# EAGLE design MAIN_BOARD (EAGLE 9.6.1)

## Sheet 1 of 3
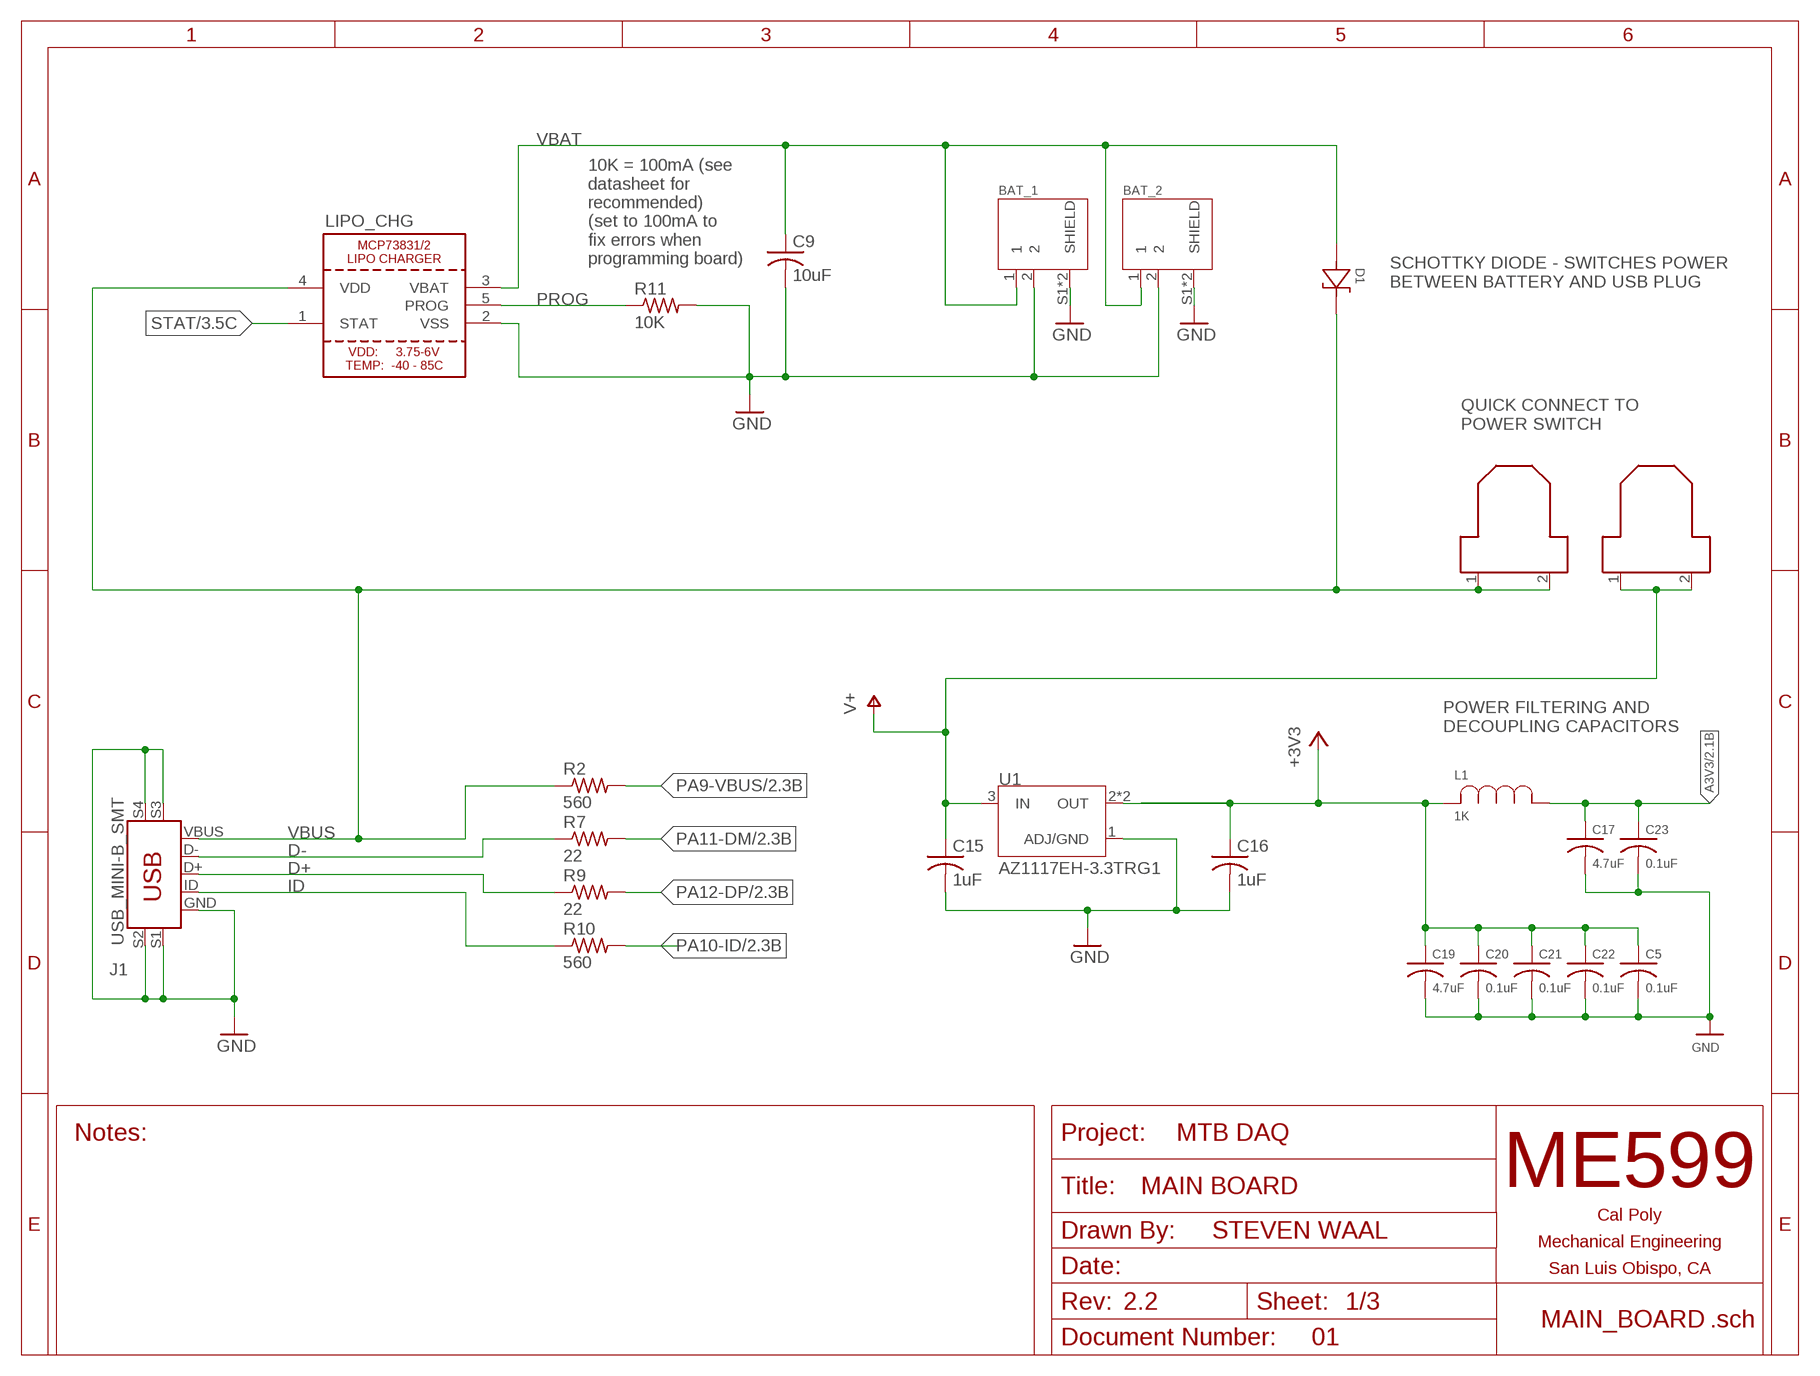
[diagram p0: schematic, sheet 1]
FRAME1 (TITLEBLOCK): AUTHOR: STEVEN WAAL; BOARD_NAME: MAIN BOARD; DOC_NUM: 01; PROJECT_NAME: MTB DAQ; REVISION: 2.2

### Parts
(+)  QUICK_CONNECT_0.187"  [QUICK_CONNECT_0.187"]
(-)  QUICK_CONNECT_0.187"  [QUICK_CONNECT_0.187"]
BAT_1  S2B-PH-SM4-TB(LF)(SN)  [JST_S2B-PH-SM4-TB(LF)(SN)]
BAT_2  S2B-PH-SM4-TB(LF)(SN)  [JST_S2B-PH-SM4-TB(LF)(SN)]
C5  0.1uF  C-USC0805  [C0805]
C9  10uF  C-USC0805  [C0805]
C15  1uF  C-USC0805  [C0805]
C16  1uF  C-USC0805  [C0805]
C17  4.7uF  C-USC0805  [C0805]
C19  4.7uF  C-USC0805  [C0805]
C20  0.1uF  C-USC0805  [C0805]
C21  0.1uF  C-USC0805  [C0805]
C22  0.1uF  C-USC0805  [C0805]
C23  0.1uF  C-USC0805  [C0805]
D1  DIODE_SCHOTTKY  [DIODE_SOD123W_1P9X2P8]
J1  USB_MINI-B_SMT  [USB-MINIB]
L1  1K  BEAD_120OHMS_100MHZ  [IND_VISHAY_ILHB0805]
LIPO_CHG  LIPO_CHARGER_MCP73831/2  [SOT23-5]
R2  560  R-US_R0805  [R0805]
R7  22  R-US_R0805  [R0805]
R9  22  R-US_R0805  [R0805]
R10  560  R-US_R0805  [R0805]
R11  10K  R-US_R0805  [R0805]
U1  AZ1117EH-3.3TRG1  [SOT230P700X180-4N]

### Nets
+3V3: C5.1 C16.1 C19.1 C20.1 C21.1 C22.1 L1.2 U1.2(OUT) U1.4(OUT) ; also sheet 2,3
A3V3: C17.1 C23.1 L1.1 ; also sheet 2
D+: J1.D+ R9.1
D-: J1.D- R7.1
GND: BAT_1.2 BAT_1.S1(SHIELD) BAT_1.S2(SHIELD) BAT_2.2 BAT_2.S1(SHIELD) BAT_2.S2(SHIELD) C5.2 C9.2 C15.2 C16.2 C17.2 C19.2 C20.2 C21.2 C22.2 C23.2 J1.GND J1.S1(SHIELD) J1.S2(SHIELD1) J1.S3(SHIELD2) J1.S4(SHIELD3) LIPO_CHG.2(VSS) R11.2 U1.1(ADJ/GND) ; also sheet 2,3
ID: J1.ID R10.1
PA9-VBUS: R2.2 ; also sheet 2
PA10-ID: R10.2 ; also sheet 2,3
PA11-DM: R7.2 ; also sheet 2
PA12-DP: R9.2 ; also sheet 2
PROG: LIPO_CHG.5(PROG) R11.1
STAT: LIPO_CHG.1(STAT) ; also sheet 3
V+: (-).1 (-).2 C15.1 U1.3(IN)
VBAT: BAT_1.1 BAT_2.1 C9.1 D1.2 LIPO_CHG.3(VBAT)
VBUS: (+).1 (+).2 D1.1 J1.VBUS LIPO_CHG.4(VDD) R2.1 ; also sheet 3

### Notes on the sheet
- 10K = 100mA (see
  datasheet for
  recommended)
  (set to 100mA to
  fix errors when 
  programming board)
- SCHOTTKY DIODE - SWITCHES POWER
  BETWEEN BATTERY AND USB PLUG
- QUICK CONNECT TO
  POWER SWITCH
- POWER FILTERING AND
  DECOUPLING CAPACITORS

## Sheet 2 of 3
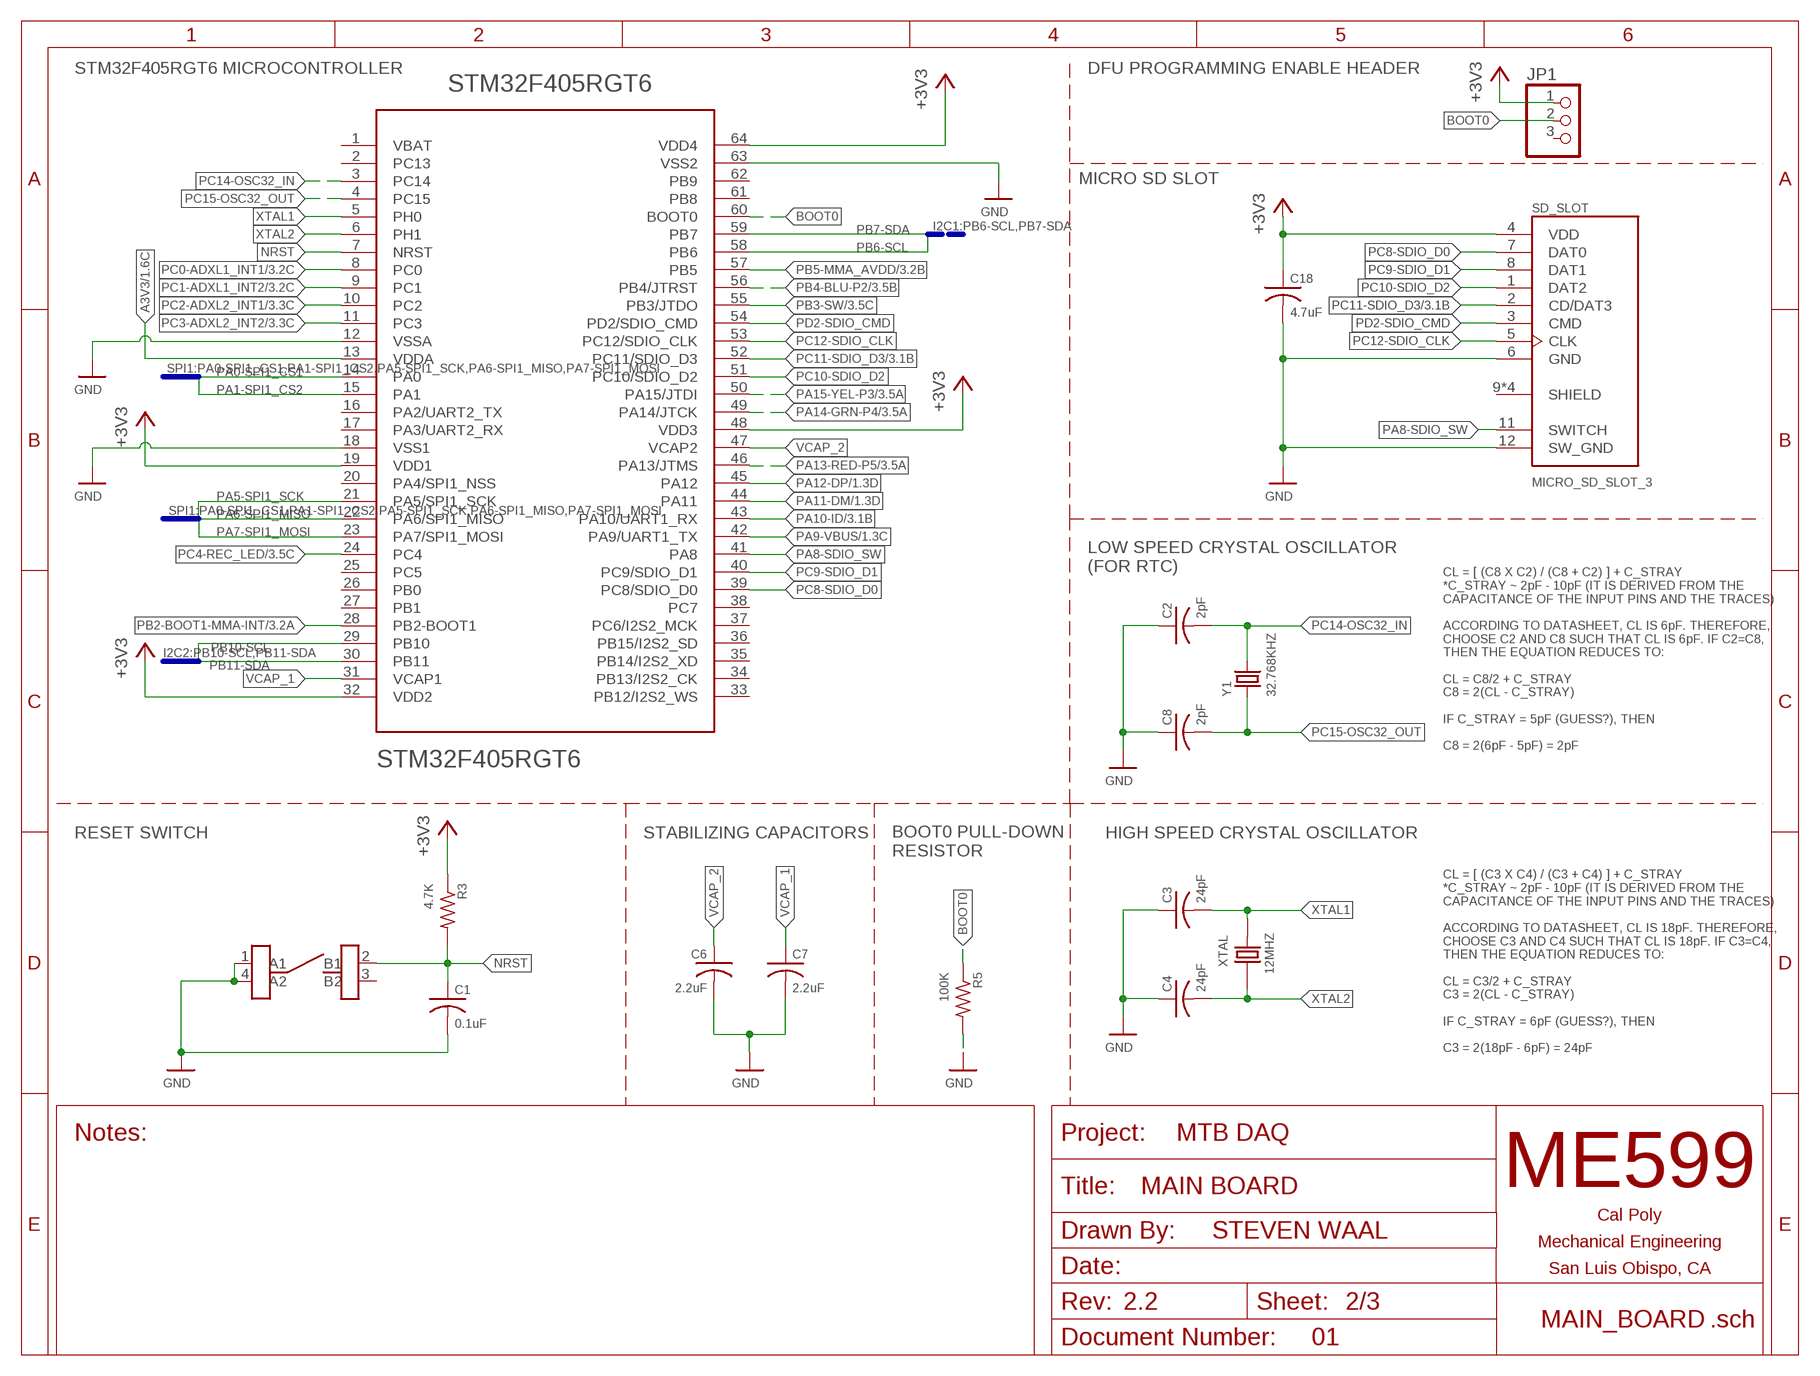
[diagram p1: schematic, sheet 2]
FRAME3 (TITLEBLOCK): AUTHOR: STEVEN WAAL; BOARD_NAME: MAIN BOARD; DOC_NUM: 01; PROJECT_NAME: MTB DAQ; REVISION: 2.2

### Parts
C1  0.1uF  C-USC0805  [C0805]
C2  2pF  C-USC0805  [C0805]
C3  24pF  C-USC0805  [C0805]
C4  24pF  C-USC0805  [C0805]
C6  2.2uF  C-USC0805  [C0805]
C7  2.2uF  C-USC0805  [C0805]
C8  2pF  C-USC0805  [C0805]
C18  4.7uF  C-USC0805  [C0805]
JP1  PINHD-1X3  [1X03]
R3  4.7K  R-US_R0805  [R0805]
R5  100K  R-US_R0805  [R0805]
RESET  SWITCH  [SWITCH_FSM6JSMATR]
SD_SLOT  MICRO_SD_SLOT_3  [CON00218_8]
STM32F405RGT6  STM32F405RGT6  STM32F405RG  [TQFP64]
XTAL  12MHZ  XTAL_SFM  [XTAL_ECS-120-18-5PX-TR]
Y1  32.768KHZ  ABS25-32.768KHZ-6-1-T  [XTAL_ABS25-32.768KHZ-6-1-T]

### Nets
+3V3: C18.1 JP1.1 R3.1 SD_SLOT.4(VDD) STM32F405RGT6.19(VDD1) STM32F405RGT6.32(VDD2) STM32F405RGT6.48(VDD3) STM32F405RGT6.64(VDD4) ; also sheet 1,3
A3V3: STM32F405RGT6.13(VDDA) ; also sheet 1
BOOT0: JP1.2 R5.1 STM32F405RGT6.60(BOOT0)
GND: C1.2 C2.1 C3.1 C4.1 C6.2 C7.2 C8.1 C18.2 R5.2 RESET.1(A1) RESET.4(A2) SD_SLOT.6(GND) SD_SLOT.12(SW_GND) STM32F405RGT6.12(VSSA) STM32F405RGT6.18(VSS1) STM32F405RGT6.63(VSS2) ; also sheet 1,3
NRST: C1.1 R3.2 RESET.2(B1) STM32F405RGT6.7(NRST)
PA0-SPI1_CS1: STM32F405RGT6.14(PA0) ; also sheet 3
PA1-SPI1_CS2: STM32F405RGT6.15(PA1) ; also sheet 3
PA5-SPI1_SCK: STM32F405RGT6.21(PA5/SPI1_SCK) ; also sheet 3
PA6-SPI1_MISO: STM32F405RGT6.22(PA6/SPI1_MISO) ; also sheet 3
PA7-SPI1_MOSI: STM32F405RGT6.23(PA7/SPI1_MOSI) ; also sheet 3
PA8-SDIO_SW: SD_SLOT.11(SWITCH) STM32F405RGT6.41(PA8)
PA9-VBUS: STM32F405RGT6.42(PA9/UART1_TX) ; also sheet 1
PA10-ID: STM32F405RGT6.43(PA10/UART1_RX) ; also sheet 1,3
PA11-DM: STM32F405RGT6.44(PA11) ; also sheet 1
PA12-DP: STM32F405RGT6.45(PA12) ; also sheet 1
PA13-RED-P5: STM32F405RGT6.46(PA13/JTMS) ; also sheet 3
PA14-GRN-P4: STM32F405RGT6.49(PA14/JTCK) ; also sheet 3
PA15-YEL-P3: STM32F405RGT6.50(PA15/JTDI) ; also sheet 3
PB2-BOOT1-MMA-INT: STM32F405RGT6.28(PB2-BOOT1) ; also sheet 3
PB3-SW: STM32F405RGT6.55(PB3/JTDO) ; also sheet 3
PB4-BLU-P2: STM32F405RGT6.56(PB4/JTRST) ; also sheet 3
PB5-MMA_AVDD: STM32F405RGT6.57(PB5) ; also sheet 3
PB6-SCL: STM32F405RGT6.58(PB6) ; also sheet 3
PB7-SDA: STM32F405RGT6.59(PB7) ; also sheet 3
PB10-SCL: STM32F405RGT6.29(PB10) ; also sheet 3
PB11-SDA: STM32F405RGT6.30(PB11) ; also sheet 3
PC0-ADXL1_INT1: STM32F405RGT6.8(PC0) ; also sheet 3
PC1-ADXL1_INT2: STM32F405RGT6.9(PC1) ; also sheet 3
PC2-ADXL2_INT1: STM32F405RGT6.10(PC2) ; also sheet 3
PC3-ADXL2_INT2: STM32F405RGT6.11(PC3) ; also sheet 3
PC4-REC_LED: STM32F405RGT6.24(PC4) ; also sheet 3
PC8-SDIO_D0: SD_SLOT.7(DAT0) STM32F405RGT6.39(PC8/SDIO_D0)
PC9-SDIO_D1: SD_SLOT.8(DAT1) STM32F405RGT6.40(PC9/SDIO_D1)
PC10-SDIO_D2: SD_SLOT.1(DAT2) STM32F405RGT6.51(PC10/SDIO_D2)
PC11-SDIO_D3: SD_SLOT.2(CD/DAT3) STM32F405RGT6.52(PC11/SDIO_D3) ; also sheet 3
PC12-SDIO_CLK: SD_SLOT.5(CLK) STM32F405RGT6.53(PC12/SDIO_CLK)
PC14-OSC32_IN: C2.2 STM32F405RGT6.3(PC14) Y1.4
PC15-OSC32_OUT: C8.2 STM32F405RGT6.4(PC15) Y1.1
PD2-SDIO_CMD: SD_SLOT.3(CMD) STM32F405RGT6.54(PD2/SDIO_CMD)
VCAP_1: C7.1 STM32F405RGT6.31(VCAP1)
VCAP_2: C6.1 STM32F405RGT6.47(VCAP2)
XTAL1: C3.2 STM32F405RGT6.5(PH0) XTAL.2
XTAL2: C4.2 STM32F405RGT6.6(PH1) XTAL.1
Unconnected: JP1.3 RESET.3(B2) SD_SLOT.9(SHIELD) SD_SLOT.10(SHIELD) SD_SLOT.13(SHIELD) SD_SLOT.14(SHIELD) STM32F405RGT6.1(VBAT) STM32F405RGT6.2(PC13) STM32F405RGT6.16(PA2/UART2_TX) STM32F405RGT6.17(PA3/UART2_RX) STM32F405RGT6.20(PA4/SPI1_NSS) STM32F405RGT6.25(PC5) STM32F405RGT6.26(PB0) STM32F405RGT6.27(PB1) STM32F405RGT6.33(PB12/I2S2_WS) STM32F405RGT6.34(PB13/I2S2_CK) STM32F405RGT6.35(PB14/I2S2_XD) STM32F405RGT6.36(PB15/I2S2_SD) STM32F405RGT6.37(PC6/I2S2_MCK) STM32F405RGT6.38(PC7) STM32F405RGT6.61(PB8) STM32F405RGT6.62(PB9)

### Buses
SPI1:PA0-SPI1_CS1,PA1-SPI1_CS2,PA5-SPI1_SCK,PA6-SPI1_MISO,PA7-SPI1_MOSI
I2C1:PB6-SCL,PB7-SDA
I2C2:PB10-SCL,PB11-SDA

### Notes on the sheet
- STM32F405RGT6 MICROCONTROLLER | DFU PROGRAMMING ENABLE HEADER
- MICRO SD SLOT
- LOW SPEED CRYSTAL OSCILLATOR
  (FOR RTC)
- CL = [ (C8 X C2) / (C8 + C2) ] + C_STRAY
  *C_STRAY ~ 2pF - 10pF (IT IS DERIVED FROM THE
  CAPACITANCE OF THE INPUT PINS AND THE TRACES)
  
  ACCORDING TO DATASHEET, CL IS 6pF. THEREFORE,
  CHOOSE C2 AND C8 SUCH THAT CL IS 6pF. IF C2=C8,
  THEN THE EQUATION REDUCES TO:
  
  CL = C8/2 + C_STRAY
  C8 = 2(CL - C_STRAY)
  
  IF C_STRAY = 5pF (GUESS?), THEN
  
  C8 = 2(6pF - 5pF) = 2pF
- RESET SWITCH | STABILIZING CAPACITORS | HIGH SPEED CRYSTAL OSCILLATOR
- BOOT0 PULL-DOWN
  RESISTOR
- CL = [ (C3 X C4) / (C3 + C4) ] + C_STRAY
  *C_STRAY ~ 2pF - 10pF (IT IS DERIVED FROM THE
  CAPACITANCE OF THE INPUT PINS AND THE TRACES)
  
  ACCORDING TO DATASHEET, CL IS 18pF. THEREFORE,
  CHOOSE C3 AND C4 SUCH THAT CL IS 18pF. IF C3=C4,
  THEN THE EQUATION REDUCES TO:
  
  CL = C3/2 + C_STRAY
  C3 = 2(CL - C_STRAY)
  
  IF C_STRAY = 6pF (GUESS?), THEN
  
  C3 = 2(18pF - 6pF) = 24pF

## Sheet 3 of 3
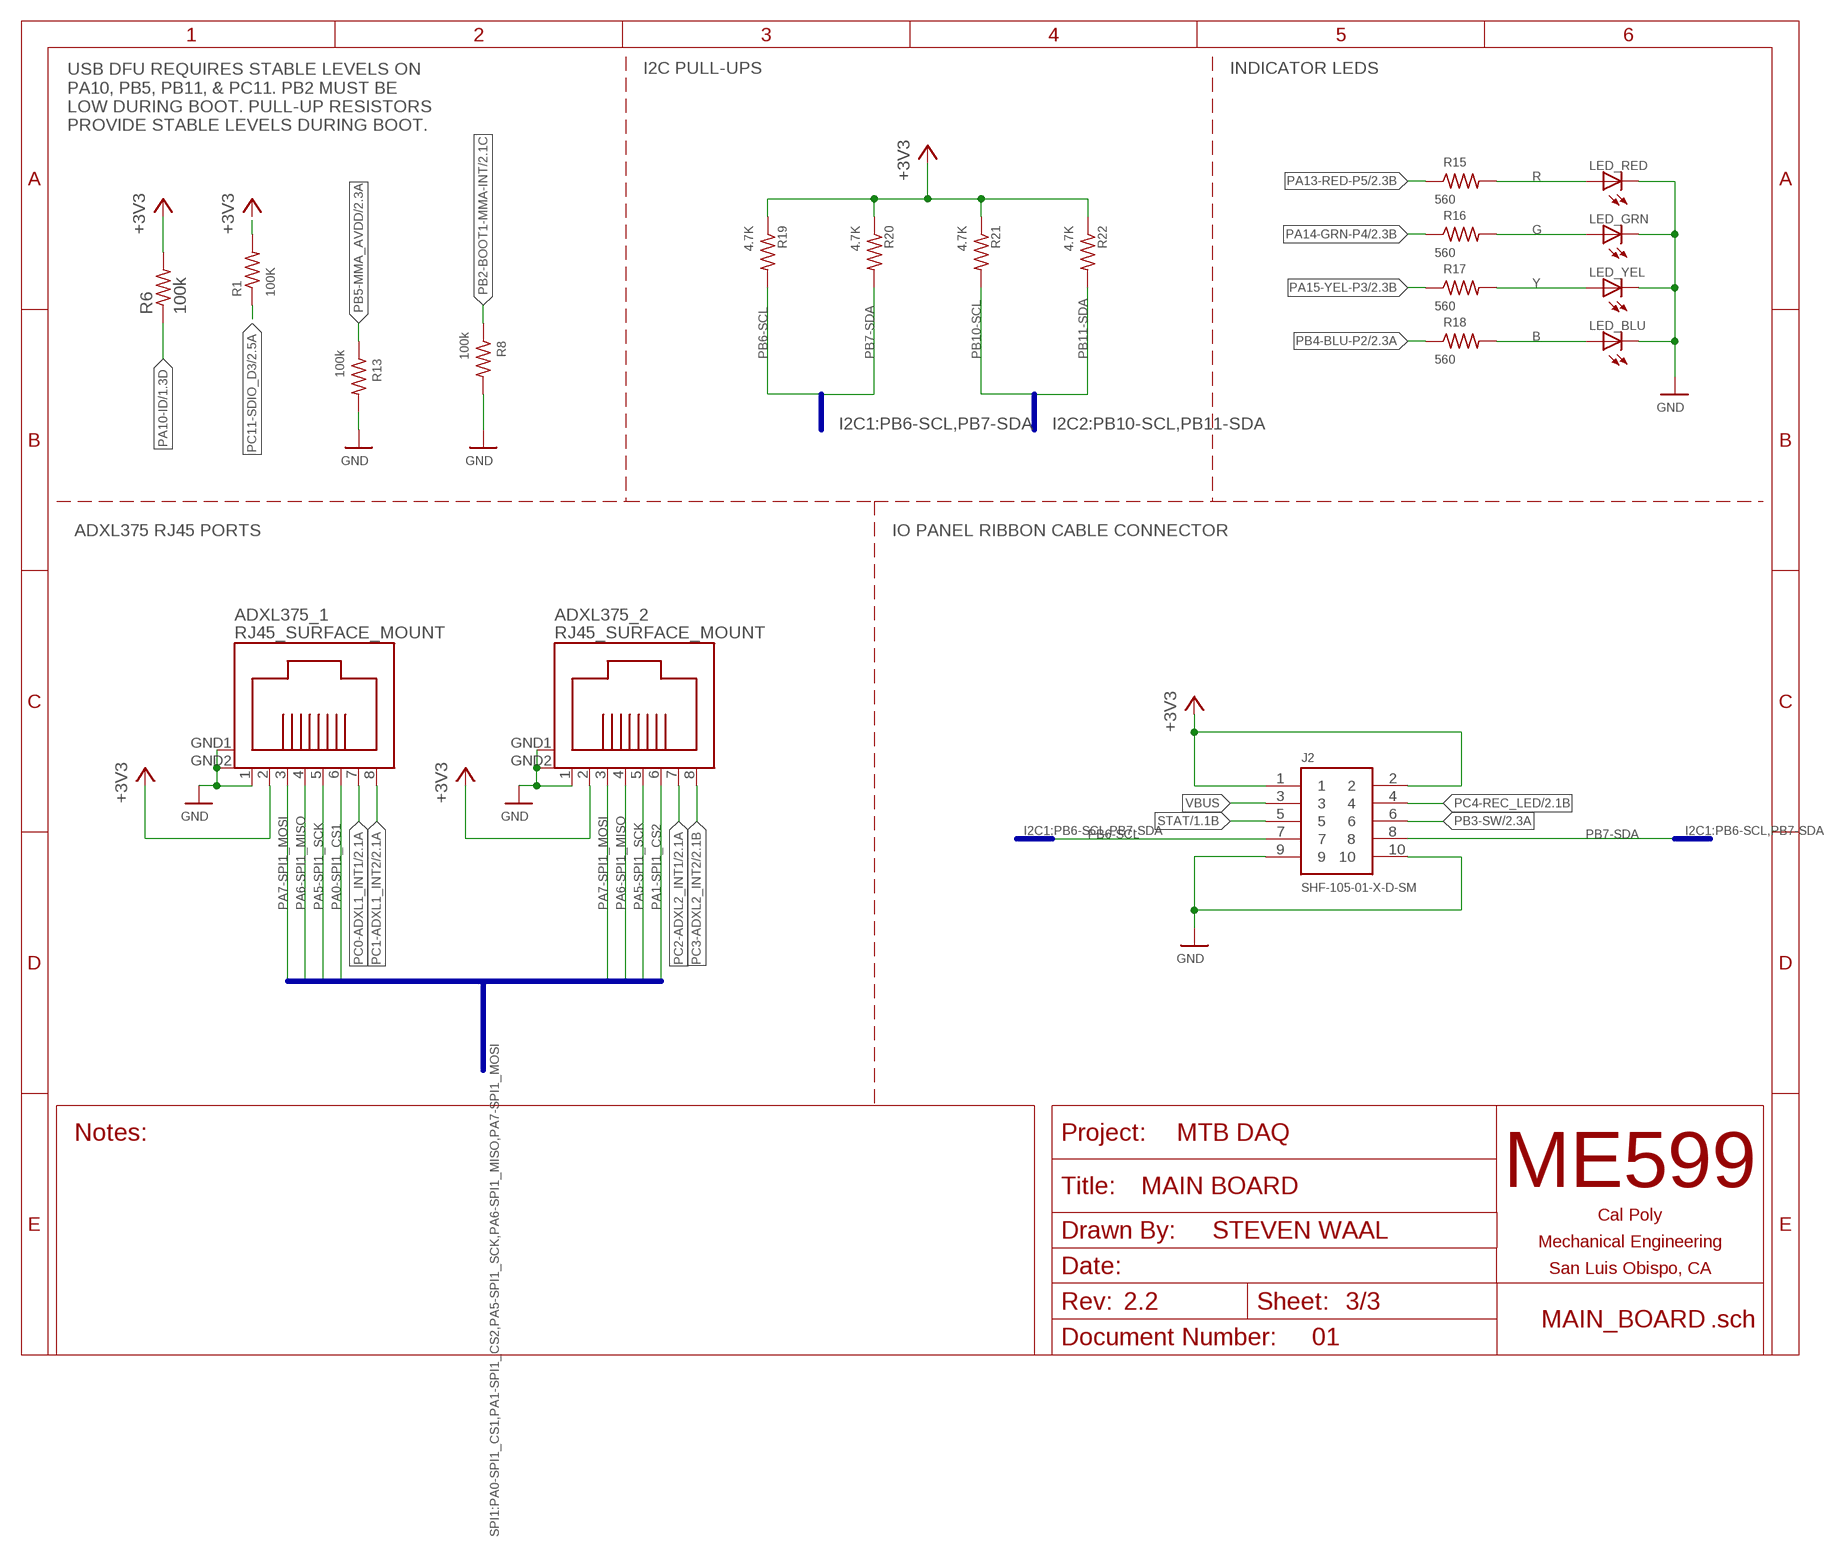
[diagram p2: schematic, sheet 3]
FRAME5 (TITLEBLOCK): AUTHOR: STEVEN WAAL; BOARD_NAME: MAIN BOARD; DOC_NUM: 01; PROJECT_NAME: MTB DAQ; REVISION: 2.2

### Parts
ADXL375_1  RJ45_SURFACE_MOUNT  [RJ45_SURFACE_MOUNT]
ADXL375_2  RJ45_SURFACE_MOUNT  [RJ45_SURFACE_MOUNT]
J2  SHF-105-01-X-D-SM  [SHF-105-01-X-D-SM]
LED_BLU  LED_0805LED_0805  [0805]
LED_GRN  LED_0805LED_0805  [0805]
LED_RED  LED_0805LED_0805  [0805]
LED_YEL  LED_0805LED_0805  [0805]
R1  100K  R-US_R0805  [R0805]
R6  100k  R-US_R0805  [R0805]
R8  100k  R-US_R0805  [R0805]
R13  100k  R-US_R0805  [R0805]
R15  560  R-US_R0805  [R0805]
R16  560  R-US_R0805  [R0805]
R17  560  R-US_R0805  [R0805]
R18  560  R-US_R0805  [R0805]
R19  4.7K  R-US_R0805  [R0805]
R20  4.7K  R-US_R0805  [R0805]
R21  4.7K  R-US_R0805  [R0805]
R22  4.7K  R-US_R0805  [R0805]

### Nets
+3V3: ADXL375_1.2 ADXL375_2.2 J2.1 J2.2 R1.2 R6.2 R19.1 R20.1 R21.1 R22.1 ; also sheet 1,2
B: LED_BLU.1 R18.2
G: LED_GRN.1 R16.2
GND: ADXL375_1.1 ADXL375_1.GND1 ADXL375_1.GND2 ADXL375_2.1 ADXL375_2.GND1 ADXL375_2.GND2 J2.9 J2.10 LED_BLU.2 LED_GRN.2 LED_RED.2 LED_YEL.2 R8.2 R13.2 ; also sheet 1,2
PA0-SPI1_CS1: ADXL375_1.6 ; also sheet 2
PA1-SPI1_CS2: ADXL375_2.6 ; also sheet 2
PA5-SPI1_SCK: ADXL375_1.5 ADXL375_2.5 ; also sheet 2
PA6-SPI1_MISO: ADXL375_1.4 ADXL375_2.4 ; also sheet 2
PA7-SPI1_MOSI: ADXL375_1.3 ADXL375_2.3 ; also sheet 2
PA10-ID: R6.1 ; also sheet 1,2
PA13-RED-P5: R15.1 ; also sheet 2
PA14-GRN-P4: R16.1 ; also sheet 2
PA15-YEL-P3: R17.1 ; also sheet 2
PB2-BOOT1-MMA-INT: R8.1 ; also sheet 2
PB3-SW: J2.6 ; also sheet 2
PB4-BLU-P2: R18.1 ; also sheet 2
PB5-MMA_AVDD: R13.1 ; also sheet 2
PB6-SCL: J2.7 R19.2 ; also sheet 2
PB7-SDA: J2.8 R20.2 ; also sheet 2
PB10-SCL: R21.2 ; also sheet 2
PB11-SDA: R22.2 ; also sheet 2
PC0-ADXL1_INT1: ADXL375_1.7 ; also sheet 2
PC1-ADXL1_INT2: ADXL375_1.8 ; also sheet 2
PC2-ADXL2_INT1: ADXL375_2.7 ; also sheet 2
PC3-ADXL2_INT2: ADXL375_2.8 ; also sheet 2
PC4-REC_LED: J2.4 ; also sheet 2
PC11-SDIO_D3: R1.1 ; also sheet 2
R: LED_RED.1 R15.2
STAT: J2.5 ; also sheet 1
VBUS: J2.3 ; also sheet 1
Y: LED_YEL.1 R17.2

### Buses
I2C1:PB6-SCL,PB7-SDA
I2C2:PB10-SCL,PB11-SDA
SPI1:PA0-SPI1_CS1,PA1-SPI1_CS2,PA5-SPI1_SCK,PA6-SPI1_MISO,PA7-SPI1_MOSI

### Notes on the sheet
- I2C PULL-UPS | INDICATOR LEDS
- USB DFU REQUIRES STABLE LEVELS ON
  PA10, PB5, PB11, & PC11. PB2 MUST BE 
  LOW DURING BOOT. PULL-UP RESISTORS 
  PROVIDE STABLE LEVELS DURING BOOT.
- ADXL375 RJ45 PORTS | IO PANEL RIBBON CABLE CONNECTOR

## Library data of the parts
(+) (-) = DigikeyLibrary:QUICK_CONNECT_0.187": DIGIKEY PART NO. WM6456-ND MFG. MOLEX MFG. PART NO. 0197084011 DESCRIPTION: CONN QC TAB 0.187 SOLDER THROUGH HOLE
ADXL375_1 ADXL375_2 = DigikeyLibrary:RJ45_SURFACE_MOUNT: Digikey Part No. RJCSE538001CT-ND MFG. Amphenol ICC (Commercial Products) MFG. PART NO. RJCSE538001
BAT_1 BAT_2 = DigikeyLibrary:S2B-PH-SM4-TB(LF)(SN): PH Series 2 Position 2 mm Pitch Surface Mount Side Entry Shrouded Header; DESCRIPTION: Connector Header Surface Mount, Right Angle 2 position 0.079 _2.00mm_; DIGI-KEY_PART_NUMBER: 455-1749-1-ND; DIGI-KEY_PURCHASE_URL: https://www.digikey.com/product-detail/en/jst-sales-america-inc/S2B-PH-SM4-TB_LF__SN_/455-1749-1-ND/926846?utm_source=snapeda&utm_medium=aggregator&utm_campaign=symbol; MF: JST Sales; MP: S2B-PH-SM4-TB_LF__SN_; PACKAGE: None
C1-C9 C15-C23 = rcl:C-US: CAPACITOR, American symbol; SPICEPREFIX: C
D1 = DigikeyLibrary:DIODE_SCHOTTKY; BUILT_BY: EMA_Anthony; COPYRIGHT: Copyright (C) 2016 Accelerated Designs. All rights reserved; MANUFACTURER_PART_NUMBER: PMEG2010ER; VENDOR: Nexperia
J1 = DigikeyLibrary:USB_MINI-B: USB type Mini-B Connector Breaks out 5th pin, and includes shield pins if needed. SparkFun Products: SparkFun FTDI Basic Breakout <https://www.sparkfun.com/products/9716> SparkFun XBee Explorer USB <https://www.sparkfun.com/products/11812> SparkFun Redboard <https://www.sparkfun.com/products/12757>; PROD_ID: CONN-08193; SF_ID: PRT-00587
J2 = DigikeyLibrary:SHF-105-01-X-D-SM: 0.050"X0.050" SHROUDED TERMINAL STRIP ASSEMBLY, 10PINS.; AVAILABILITY: Unavailable; DESCRIPTION: Connector Header Surface Mount 10 position 0.050 _1.27mm_; MF: Samtec; MP: SHF-105-01-L-D-SM; PACKAGE: None; PRICE: None
JP1 = pinhead:PINHD-1X3: PIN HEADER
L1 = DigikeyLibrary:BEAD_120OHMS_100MHZ: 120 Ohms @ 100MHz 1 Ferrite Bead 0805 (2012 Metric) 5A 30 mOhm Digikey Part No: 541-2299-1-ND Link: https://www.digikey.com/product-detail/en/vishay-dale/ILHB0805ER121V/541-2299-1-ND/5168396; MANUFACTURER_PART_NUMBER: ILHB0805ER121V; VENDOR: VISHAY
LED_BLU LED_GRN LED_RED LED_YEL = DigikeyLibrary:LED_0805: LED with an 0805 package
LIPO_CHG = DigikeyLibrary:LIPO_CHARGER_MCP73831/2: DIGIKEY PART NO. MCP73831T-2ACI/OTCT-ND
R1-R3 R5-R11 R13 R15-R22 = rcl:R-US_: RESISTOR, American symbol; SPICEPREFIX: R
RESET = DigikeyLibrary:SWITCH: Tactile Switch SPST-NO Top Actuated Surface Mount Digikey Part No: 450-2058-1-ND Link: https://www.digikey.com/product-detail/en/te-connectivity-alcoswitch-switches/FSM6JSMATR/450-2058-1-ND/4569748; MANUFACTURER_PART_NUMBER: FSM6JSMATR; VENDOR: TE Connectivity
SD_SLOT = DigikeyLibrary:MICRO_SD_SLOT_3: CONN MICRO SD CARD PUSH-PUSH R/A; DIGIKEY_PART_NO: WM24066CT-ND; MFG: Molex; MFG_PART_NO: 5027740891
STM32F405RGT6 = DigikeyLibrary:STM32F405RG: STM32F405RGT6 ARM DSP Chip used on the WAV Trigger board. IC MCU 32BIT 1MB FLASH 64LQFP Datasheet <https://cdn.sparkfun.com/datasheets/Widgets/STM32F405RGT6.pdf> SparkFun Products WAV Trigger <https://www.sparkfun.com/products/13660> (WIG-13660); PROD_ID: IC-11709
U1 = DigikeyLibrary:AZ1117EH-3.3TRG1: Ldo.Vreg Pos 3, 3v 1a Sot223; DESCRIPTION: Ldo.Vreg Pos 3, 3v 1a Sot223; DIGI-KEY_PART_NUMBER: AZ1117EH-3.3TRG1DICT-ND; DIGI-KEY_PURCHASE_URL: https://www.digikey.com/product-detail/en/diodes-incorporated/AZ1117EH-3.3TRG1/AZ1117EH-3.3TRG1DICT-ND/5001336?utm_source=snapeda&utm_medium=aggregator&utm_campaign=symbol; MF: Diodes Inc.; MP: AZ1117EH-3.3TRG1; PACKAGE: SOT-223 Diodes Inc.
XTAL = DigikeyLibrary:XTAL_SFM: CRYSTAL SMD; DESCRIPTION: 12MHz ±30ppm Crystal 18pF 50 Ohms HC-49/US; DIGI-KEY_PART_NUMBER: XC1289CT-ND; DIGI-KEY_PURCHASE_URL: https://www.digikey.com/product-detail/en/ecs-inc/ECS-120-18-5PX-TR/XC1289CT-ND/827753?utm_source=snapeda&utm_medium=aggregator&utm_campaign=symbol; MF: ECS Inc.; MP: ECS-120-18-5PX-TR; PACKAGE: HC49/US ECS International
Y1 = DigikeyLibrary:ABS25-32.768KHZ-6-1-T: ABS25 Series 32.768 kHz ±10 ppm 6 pF -40 to +85 °C SMT Low Frequency Crystal; DESCRIPTION: 32.768kHz ±10ppm Crystal 6pF 50 kOhms 4-SOJ, 5.50mm pitch; DIGI-KEY_PART_NUMBER: 535-10241-1-ND; DIGI-KEY_PURCHASE_URL: https://www.digikey.com/product-detail/en/abracon-llc/ABS25-32.768KHZ-6-1-T/535-10241-1-ND/2218054?utm_source=snapeda&utm_medium=aggregator&utm_campaign=symbol; MF: Abracon; MP: ABS25-32.768KHZ-6-1-T; PACKAGE: 4-4 Abracon

## Board
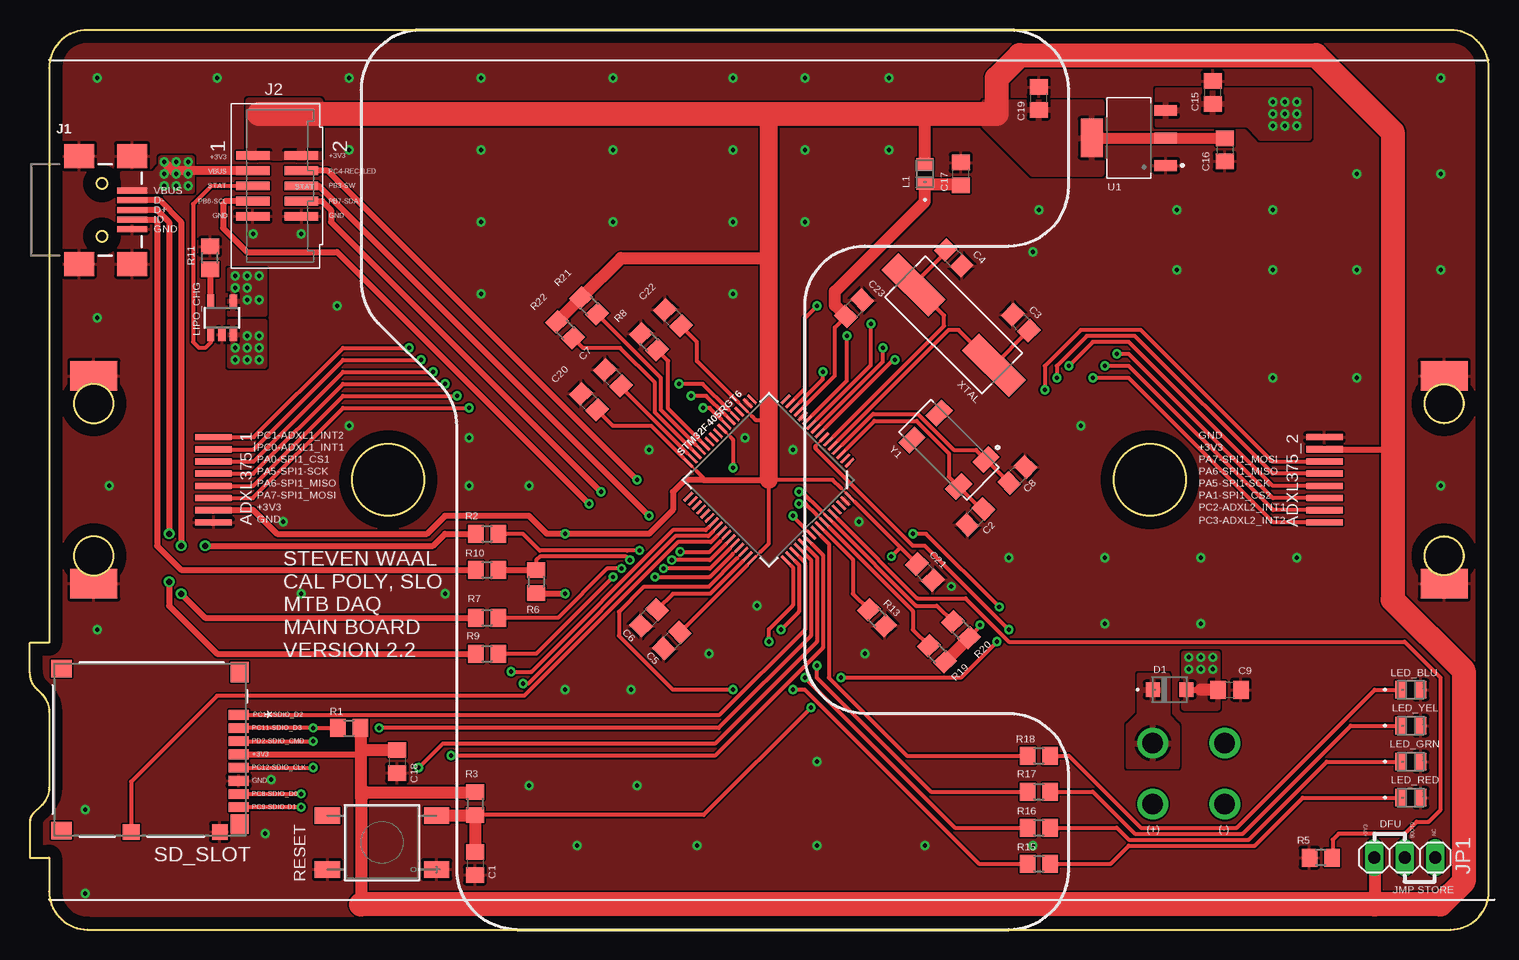
[diagram p3: board, top side]
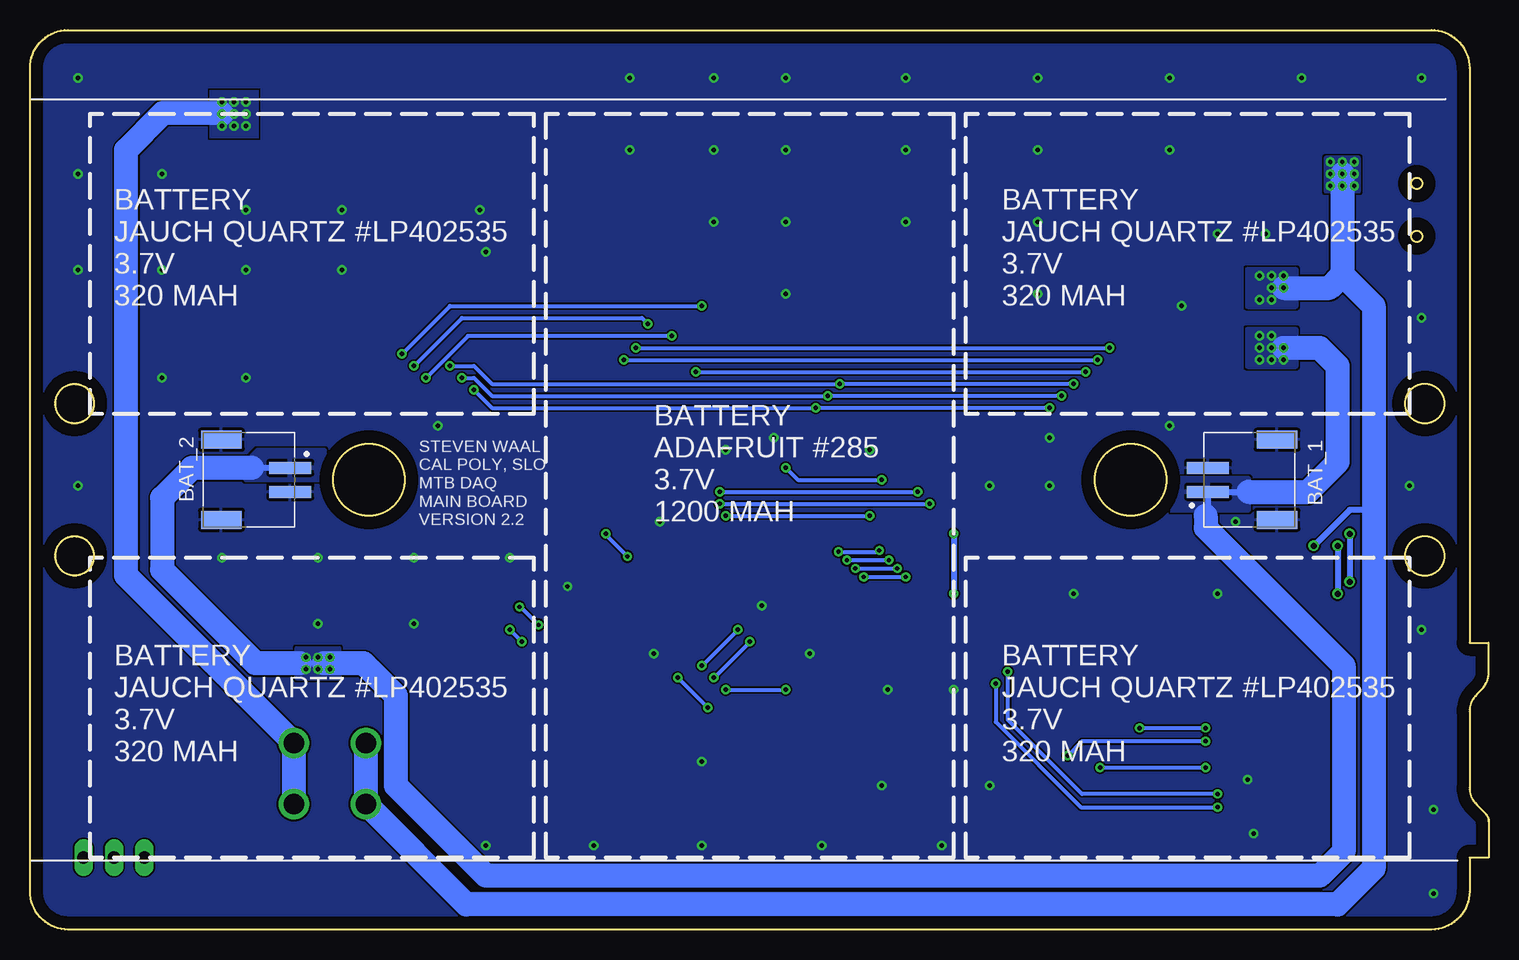
[diagram p4: board, bottom side, seen from below]

Size 121.6 x 75 mm. Coordinates in mm from the lower left corner, seen from the top.
Outline: 116.26,43.8 116.26,43.9 116.26,44.01 116.28,44.12 116.3,44.22 116.33,44.32 116.36,44.42 116.4,44.52 116.45,44.62 116.5,44.71 116.56,44.8 116.62,44.88 116.69,44.96 116.77,45.04 116.85,45.11 116.93,45.17 117.02,45.23 117.11,45.28 117.21,45.33 117.31,45.37 117.41,45.41 117.51,45.43 117.62,45.45 117.72,45.47 117.83,45.48 117.93,45.48 118.04,45.47 118.15,45.45 118.25,45.43 118.35,45.41 118.45,45.37 118.55,45.33 118.65,45.28 118.74,45.23 118.83,45.17 118.91,45.11 118.99,45.04 119.07,44.96 119.14,44.88 119.2,44.8 119.26,44.71 119.32,44.62 119.36,44.52 119.4,44.42 119.44,44.32 119.47,44.22 119.49,44.12 119.5,44.01 119.51,43.9 119.51,43.8 119.5,43.69 119.49,43.59 119.47,43.48 119.44,43.38 119.4,43.28 119.36,43.18 119.32,43.08 119.26,42.99 119.2,42.9 119.14,42.82 119.07,42.74 118.99,42.66 118.91,42.59 118.83,42.53 118.74,42.47 118.65,42.42 118.55,42.37 118.45,42.33 118.35,42.29 118.25,42.27 118.15,42.24 118.04,42.23 117.93,42.22 117.83,42.22 117.72,42.23 117.62,42.24 117.51,42.27 117.41,42.29 117.31,42.33 117.21,42.37 117.11,42.42 117.02,42.47 116.93,42.53 116.85,42.59 116.77,42.66 116.69,42.74 116.62,42.82 116.56,42.9 116.5,42.99 116.45,43.08 116.4,43.18 116.36,43.28 116.33,43.38 116.3,43.48 116.28,43.59 116.26,43.69 116.26,43.8
Outline: 116.26,31.1 116.26,31.2 116.26,31.31 116.28,31.41 116.3,31.52 116.33,31.62 116.36,31.72 116.4,31.82 116.45,31.92 116.5,32.01 116.56,32.1 116.62,32.18 116.69,32.26 116.77,32.34 116.85,32.41 116.93,32.47 117.02,32.53 117.11,32.58 117.21,32.63 117.31,32.67 117.41,32.71 117.51,32.73 117.62,32.76 117.72,32.77 117.83,32.78 117.93,32.78 118.04,32.77 118.15,32.76 118.25,32.73 118.35,32.71 118.45,32.67 118.55,32.63 118.65,32.58 118.74,32.53 118.83,32.47 118.91,32.41 118.99,32.34 119.07,32.26 119.14,32.18 119.2,32.1 119.26,32.01 119.32,31.92 119.36,31.82 119.4,31.72 119.44,31.62 119.47,31.52 119.49,31.41 119.5,31.31 119.51,31.2 119.51,31.1 119.5,30.99 119.49,30.89 119.47,30.78 119.44,30.68 119.4,30.58 119.36,30.48 119.32,30.38 119.26,30.29 119.2,30.2 119.14,30.12 119.07,30.04 118.99,29.96 118.91,29.89 118.83,29.83 118.74,29.77 118.65,29.72 118.55,29.67 118.45,29.63 118.35,29.59 118.25,29.57 118.15,29.55 118.04,29.53 117.93,29.52 117.83,29.52 117.72,29.53 117.62,29.55 117.51,29.57 117.41,29.59 117.31,29.63 117.21,29.67 117.11,29.72 117.02,29.77 116.93,29.83 116.85,29.89 116.77,29.96 116.69,30.04 116.62,30.12 116.56,30.2 116.5,30.29 116.45,30.38 116.4,30.48 116.36,30.58 116.33,30.68 116.3,30.78 116.28,30.89 116.26,30.99 116.26,31.1
Outline: 1.6,71.83 1.6,23.9 0,23.9 0,21.43 arc45 0.59,20.01 1.01,19.59 arc-45 1.6,18.17 1.6,11.83 arc-45 1.01,10.41 0.28,9.68 arc45 0,9 0,6 1.6,6 1.6,3.17 1.61,2.9 arc85 4.78,0 118.42,0 118.7,0.01 arc85 121.6,3.17 121.6,71.83 121.59,72.1 arc85 118.42,75 4.78,75 4.5,74.99 arc85 1.6,71.83
Outline: circle at 6,57.8 radius 0.45
Outline: circle at 5.32,43.85 radius 1.63
Outline: circle at 6,62.2 radius 0.45
Outline: circle at 93.35,37.5 radius 3
Outline: circle at 29.85,37.5 radius 3
Outline: circle at 5.32,31.15 radius 1.63
Copper layers (1*16): Top 0.035mm / dielectric 1.5mm / Bottom 0.035mm
Design rules "default *": minimum track width 6mil, minimum drill 0.35mm, track to track 6mil, track to pad 6mil, pad to pad 6mil, via to via 6mil, smd to smd 6mil, copper to edge 40mil, drill to drill 6mil, minimum pad ring 10mil, minimum via ring 8mil, stop-mask expansion 4mil, vias tented up to drill 20mil, thermal gap 10mil

### Footprints (pad centres in the part's own frame; a part is rotated, then mirrored left to right if it is on the bottom)
QUICK_CONNECT_0.187" = drill 1.702: 1 -2.54,0; 2 2.54,0
RJ45_SURFACE_MOUNT = smd 0.508 x 3.048: 1 3.556,0; 2 2.54,0; 3 1.524,0; 4 0.508,0; 5 -0.508,0; 6 -1.524,0; 7 -2.54,0; 8 -3.556,0 | smd 2.489 x 3.912: GND1 8.661,-9.982; GND2 -8.661,-9.982 | hole 3.251: 6.35,-9.982; -6.35,-9.982
JST_S2B-PH-SM4-TB(LF)(SN) = smd 1 x 3.5: 1 -1,0; 2 1,0 | smd 1.5 x 3.4: S1 -3.35,-5.75; S2 3.35,-5.75
C0805 = smd 1.3 x 1.5: 1 -0.95,0; 2 0.95,0
DIODE_SOD123W_1P9X2P8 = smd 1.194 x 1.194: 1 -1.397,0; 2 1.397,0
USB-MINIB = smd 2.5 x 0.5: D+ 2.5,0; D- 2.5,0.8; GND 2.5,-1.6; ID 2.5,-0.8; VBUS 2.5,1.6 | smd 2.5 x 2: S1 -1.905,4.5; S2 2.5,4.5; S3 -1.905,-4.5; S4 2.5,-4.5 | hole 0.9: 0,2.2; 0,-2.2
SHF-105-01-X-D-SM = smd 0.737 x 2.794: 1 -2.54,-2.032; 2 -2.54,2.032; 3 -1.27,-2.032; 4 -1.27,2.032; 5 0,-2.032; 6 0,2.032; 7 1.27,-2.032; 8 1.27,2.032; 9 2.54,-2.032; 10 2.54,2.032
1X03 = drill 1.016 long: 1 -2.54,0; 2 0,0; 3 2.54,0
IND_VISHAY_ILHB0805 = smd 1.016 x 1.448: 1 -0.8,0; 2 0.8,0
0805 = smd 0.965 x 1.448: 1 -0.826,0; 2 0.826,0
SOT23-5 = smd 0.6 x 1.1: 1 -0.95,-1.4; 2 0,-1.4; 3 0.95,-1.4; 4 0.95,1.4; 5 -0.95,1.4
R0805 = smd 1.3 x 1.5: 1 -0.95,0; 2 0.95,0
SWITCH_FSM6JSMATR = smd 2.108 x 1.397: 1 -9.093,4.496; 2 -9.093,0; 3 0,0; 4 0,4.496
CON00218_8 = smd 0.813 x 1.676: 1 2.899,-7.387; 2 1.799,-7.387; 3 0.699,-7.387; 4 -0.401,-7.387; 5 -1.501,-7.387; 6 -2.601,-7.387; 7 -3.701,-7.387; 8 -4.801,-7.387 | smd 1.499 x 1.702: 9 -6.751,7.374; 10 6.751,7.374 | smd 1.295 x 1.397: 11 -6.859,1.577 | smd 1.295 x 1.295: 12 -6.859,-5.823 | smd 1.6 x 1.499: 13 -6.201,-7.476 | smd 1.702 x 1.499: 14 6.449,-7.476
TQFP64 = smd 0.22 x 1: 1 -3.75,-5.75; 2 -3.25,-5.75; 3 -2.75,-5.75; 4 -2.25,-5.75; 5 -1.75,-5.75; 6 -1.25,-5.75; 7 -0.75,-5.75; 8 -0.25,-5.75; 9 0.25,-5.75; 10 0.75,-5.75; 11 1.25,-5.75; 12 1.75,-5.75; 13 2.25,-5.75; 14 2.75,-5.75; 15 3.25,-5.75; 16 3.75,-5.75; 33 3.75,5.75; 34 3.25,5.75; 35 2.75,5.75; 36 2.25,5.75; 37 1.75,5.75; 38 1.25,5.75; 39 0.75,5.75; 40 0.25,5.75; 41 -0.25,5.75; 42 -0.75,5.75; 43 -1.25,5.75; 44 -1.75,5.75; 45 -2.25,5.75; 46 -2.75,5.75; 47 -3.25,5.75; 48 -3.75,5.75 | smd 1 x 0.22: 17 5.75,-3.75; 18 5.75,-3.25; 19 5.75,-2.75; 20 5.75,-2.25; 21 5.75,-1.75; 22 5.75,-1.25; 23 5.75,-0.75; 24 5.75,-0.25; 25 5.75,0.25; 26 5.75,0.75; 27 5.75,1.25; 28 5.75,1.75; 29 5.75,2.25; 30 5.75,2.75; 31 5.75,3.25; 32 5.75,3.75; 49 -5.75,3.75; 50 -5.75,3.25; 51 -5.75,2.75; 52 -5.75,2.25; 53 -5.75,1.75; 54 -5.75,1.25; 55 -5.75,0.75; 56 -5.75,0.25; 57 -5.75,-0.25; 58 -5.75,-0.75; 59 -5.75,-1.25; 60 -5.75,-1.75; 61 -5.75,-2.25; 62 -5.75,-2.75; 63 -5.75,-3.25; 64 -5.75,-3.75
SOT230P700X180-4N = smd 1.86 x 0.9: 1 -3.075,2.3; 2 -3.075,0; 3 -3.075,-2.3 | smd 1.86 x 3.19: 4 3.075,0
XTAL_ECS-120-18-5PX-TR = smd 5.5 x 2: 1 -4.75,0; 2 4.75,0
XTAL_ABS25-32.768KHZ-6-1-T = smd 1.9 x 1.3: 1 -1.6,2.75; 2 -1.6,-2.75; 3 1.6,-2.75; 4 1.6,2.75

### Placement (x,y rotation side)
(+)  93.6,13 90 top
(-)  99.6,13 90 top
ADXL375_1  15.3,37.5 270 top
ADXL375_2  107.9,37.5 90 top
BAT_1  23.4,37.5 90 bottom
BAT_2  99.9,37.5 270 bottom
C1  37.1,5.5 270 top
C2  78.8,34.4 45 top
C3  82.6,50.6 315 top
C4  77,56 135 top
C5  53.5,24.1 225 top
C6  51.6,26 225 top
C7  48.6,46 135 top
C8  82.3,37.9 225 top
C9  100,20 0 top
C15  98.6,69.8 90 top
C16  99.6,65 270 top
C17  77.6,63 90 top
C18  30.6,14 270 top
C19  84.1,69.3 90 top
C20  46.6,44 135 top
C21  74.6,29.8 315 top
C22  53.6,51 135 top
C23  68.7,51.8 45 top
D1  95,20 0 top
J1  6,60 0 top
J2  20.6,62 270 top
JP1  114.6,6 0 top
L1  74.6,63 90 top
LED_BLU  115.1,20 0 top
LED_GRN  115.1,14 0 top
LED_RED  115.1,11 0 top
LED_YEL  115.1,17 0 top
LIPO_CHG  16,51 0 top
R1  26.6,16.8 0 top
R2  38.1,33 0 top
R3  37.1,10.5 270 top
R5  107.6,6 180 top
R6  42.2,29 270 top
R7  38.1,26 0 top
R8  51.6,49 135 top
R9  38.1,23 0 top
R10  38.1,30 0 top
R11  15,56 90 top
R13  70.6,26 315 top
R15  84.1,5.5 0 top
R16  84.1,8.5 0 top
R17  84.1,11.5 0 top
R18  84.1,14.5 0 top
R19  75.6,23 135 top
R20  77.6,25 135 top
R21  46.6,52 315 top
R22  44.6,50 315 top
RESET  24.8,9.5 180 top
SD_SLOT  10.01,15 90 top
STM32F405RGT6  61.6,37.5 135 top
U1  91.6,66 180 top
XTAL  77,50.4 315 top
Y1  76.6,40 225 top

### Tracks (layer width: path | path; a pad name or v marks a point on that pad's centre or on a via)
+3V3  (via drill 0.35)
  Top 0.22: 59.66,30.25 59.75,30.35 STM32F405RGT6.48 60.89,31.49 | 54.35,39.45 54.45,39.35 STM32F405RGT6.32 55.59,38.21 | 58.95,44.04 59.05,43.95 STM32F405RGT6.19 60.19,42.8 | 67.61,36.79 STM32F405RGT6.64 68.75,35.65 68.85,35.55
  Top 0.34: C20.1 48.6,42 51.8,42 54.45,39.35 | C22.1 55.6,49 55.6,47.39 59.05,43.95 | 113.56,40.04 113.6,40 | R20.1 79.2,25.26 v79.2,25.4 | v80.8,26.9 74.7,33 v73.6,33 | C21.1 72.55,31.85 | v71.8,31.1 72.55,31.85 | 72.55,31.85 | 60.19,42.8 60.49,42.5 61.6,42.5 | 68.75,35.65 72.55,31.85 | 67.61,36.79 66.9,37.5 61.6,37.5 61.6,32.2 60.89,31.49 | 59.75,30.35 C5.1 | 55.59,38.21 56.1,37.7 56.1,37.5
  Top 0.5: 61.6,37.5 56.1,37.5 54.6,37.5 53.6,36.5 53.6,35 51.6,33 v44.6,33 43.1,33 41.6,34.5 34.6,34.5 33.1,33 20.6,33 18.6,35 15.34,35 ADXL375_1.2 | ADXL375_2.2 113.56,40.04 | v44.6,28 42.25,28 R6.2 | SD_SLOT.4 27.2,14.6 27.6,15
  Top 0.7: 27.5,15.1 27.6,15
  Top 0.9: C16.1 99.55,66 U1.2 U1.4
  Top 1: C18.1 30.65,15 27.6,15 | R20.1 R19.1 | R1.2 27.6,16.85 27.6,15 | 27.6,11 27.6,15 | 19.24,67.86 19.1,68 | JP1.1 112.1,5.96 112.1,2.09 | 27.6,11 27.6,2.09 | 27.6,11 28.05,11.45 R3.1 | L1.2 74.6,68 | R22.1 R21.1 49.26,56 61.6,56
  Top 1.5: 61.6,37.5 61.6,42.5 61.6,56 61.6,68
  Top 2: 19.1,68 61.6,68 74.6,68 80.6,68 80.6,71 82.51,72.91 107.19,72.91 113.6,66.5 113.6,40 113.6,27.5 119.51,21.59 119.51,4 117.6,2.09 117.56,2.09 | 117.56,2.09 | 117.56,2.09 112.1,2.09 27.6,2.09
  Bottom 0.34: v80.8,26.9 80.7,26.9 v79.2,25.4 | v73.6,33 73.6,32.9 v71.8,31.1
  Bottom 0.5: v44.6,33 v44.6,28
  pour Top: 89.3,63 83.6,63 79.6,67 79.6,69 89.3,69
  pour Top: 18.3,64.5 24.1,64.5 24.1,69 18.3,69
A3V3
  Top 0.22: STM32F405RGT6.13 64.51,43.59 64.61,43.69
  Top 0.34: C23.1 67.09,50.19 67.09,46.17 64.51,43.59
  Top 1: C17.1 77.55,62.1 74.7,62.1 L1.1 74.6,60.7 67.1,53.2 67.1,52.06 C23.1
B
  Top 0.34: R18.2 86.6,14.5 92.6,8.5 100.6,8.5 112.1,20 LED_BLU.1
BOOT0
  Top 0.22: STM32F405RGT6.60 67.09,34.49 67.34,34.24
  Top 0.34: R5.1 108.6,6.05 108.6,7.5 109.1,8 114.6,8 | JP1.2 114.6,8 | 114.6,8 115.6,9 116.6,9 117.6,10 117.6,21 114.6,24 81.6,24 77.98,27.62 73.95,27.62 67.59,33.99 67.34,34.24
D+  (via drill 0.5)
  Top 0.5: v11.6,33 11.6,59 10.6,60 J1.D+ | v11.6,29 11.6,27 15.6,23 R9.1
  Bottom 0.5: v11.6,33 v11.6,29
D-  (via drill 0.5)
  Top 0.5: v12.6,32 12.6,59 10.8,60.8 J1.D- | v12.6,28 14.6,26 R7.1
  Bottom 0.5: v12.6,32 v12.6,28
G
  Top 0.34: R16.2 90.6,8.5 91.6,7.5 101.6,7.5 108.1,14 LED_GRN.1
GND  (via drill 0.35)
  other vias: 21.1,34 64.6,59 64.6,65 71.6,65 44.6,20 50.1,20 26.6,65 37.6,65 48.6,65 58.6,65 37.6,59 48.6,59 58.6,59 37.6,53 58.6,53 5.6,71 15.6,71 26.6,71 37.6,71 48.6,71 58.6,71 64.6,71 71.6,71 117.6,71 117.6,63 117.6,55 110.6,63 110.6,55 103.6,55 95.6,55 103.6,46 110.6,46 117.6,37 105.6,31 89.6,25.5 97.6,31 87.6,42 89.6,31 81.6,31 83.6,56.5 84.1,60 95.6,60 103.6,60 59.6,41 63.6,40 69.6,23 56.6,23 60.6,27 51.6,40 26.6,42 36.6,41 36.6,37 41.6,37 22.6,28 34.6,28 4.6,3 4.6,10 19.6,8 41.6,12 50.6,12 45.6,7 55.6,7 65.6,14 65.6,7 74.6,7 83.6,7 5.6,25 6.6,37 5.6,51 25.6,52 76.8,28.6 69.1,34 20.1,12.5 18.6,58 22.6,58 97.6,25.5
  pour Top (rank 6): -3.4,0 -3.4,75 121.6,75 121.6,0
  pour Bottom (rank 6): 121.6,0 -3.4,0 -3.4,75 121.6,75
ID
  Top 0.5: R10.1 12.6,30 10.6,32 10.6,59 10.4,59.2 J1.ID
NRST  (via drill 0.35)
  Top 0.22: STM32F405RGT6.7 65.49,40.33
  Top 0.34: v81.6,25 74.6,32 73.6,32 65.49,40.11 65.49,40.33 | v80.6,24 77.6,21 v67.6,21 | R3.2 56.15,9.55 v65.1,18.5
  Top 1: C1.1 R3.2 37.05,9.5 RESET.2
  Bottom 0.34: v81.6,25 v80.6,24 | v67.6,21 v65.1,18.5
PA0-SPI1_CS1  (via drill 0.35)
  Top 0.22: 64.25,44.04 STM32F405RGT6.14
  Top 0.34: 15.28,39 ADXL375_1.6 18.58,39.02 18.6,39 26.1,46.5 v33.6,46.5 | v66.1,46.5 66.1,45.89 64.16,43.95 | 64.16,43.95 | 64.16,43.95 64.25,44.04 | 64.25,44.04
  Bottom 0.34: v66.1,46.5 v33.6,46.5
PA1-SPI1_CS2  (via drill 0.35)
  Top 0.22: STM32F405RGT6.15 63.8,44.3 63.9,44.39
  Top 0.34: ADXL375_2.6 103.62,35.98 91.6,48 v90.6,48 | v65.6,52 64.6,51 64.6,45.1 63.8,44.3
  Bottom 0.34: v90.6,48 86.6,52 v65.6,52
PA5-SPI1_SCK  (via drill 0.35)
  Top 0.22: STM32F405RGT6.21 58.24,43.33
  Top 0.34: v54.1,45.5 56.08,45.5 58.24,43.33 | ADXL375_1.5 18.61,38.01 26.1,45.5 v34.6,45.5 | ADXL375_2.5 103.61,36.99 91.6,49 88.6,49 v86.6,47
  Bottom 0.34: v34.6,45.5 v54.1,45.5 83.1,45.5 84.6,47 v86.6,47
PA6-SPI1_MISO  (via drill 0.35)
  Top 0.22: STM32F405RGT6.22 57.98,42.88 57.89,42.98
  Top 0.34: v55.1,44.5 56.37,44.5 57.98,42.88 | ADXL375_1.4 18.59,36.99 26.1,44.5 v35.6,44.5 | ADXL375_2.4 103.59,38.01 92.1,49.5 88.1,49.5 85.6,47 v85.6,46
  Bottom 0.34: v35.6,44.5 v55.1,44.5 83.1,44.5 84.6,46 v85.6,46
PA7-SPI1_MOSI  (via drill 0.35)
  Top 0.22: STM32F405RGT6.23 57.63,42.53 57.53,42.63
  Top 0.34: v56.1,43.5 56.66,43.5 57.63,42.53 | 15.32,36 ADXL375_1.3 18.58,35.98 26.1,43.5 v36.6,43.5 | ADXL375_2.3 107.88,39 103.6,39 92.6,50 87.6,50 84.6,47 v84.6,45
  Bottom 0.34: v36.6,43.5 v56.1,43.5 83.1,43.5 v84.6,45
PA8-SDIO_SW
  Top 0.22: STM32F405RGT6.41 57.28,32.82 57.18,32.73
  Top 0.34: SD_SLOT.11 8.43,12.33 15.6,19.5 41.2,19.5 54,32.3 56.75,32.3 57.28,32.82
PA9-VBUS  (via drill 0.35)
  Top 0.22: 57.53,32.37 STM32F405RGT6.42
  Top 0.34: v50.8,31.6 49.79,31.6 42.5,31.6 41.1,33 R2.2 | 57.53,32.37 56.66,31.5 v54.2,31.5
  Bottom 0.34: v54.2,31.5 50.9,31.5 v50.8,31.6
PA10-ID  (via drill 0.35)
  Top 0.22: STM32F405RGT6.43 57.98,32.12 57.89,32.02
  Top 0.34: R6.1 42.25,30 42.2,30.05 42.2,30.8 42.5,31.1 49.69,31.1 v49.99,30.8 v50,30.8 | v53.5,30.8 56.67,30.8 57.98,32.12
  Top 0.5: R6.1 39.1,29.95 R10.2
  Bottom 0.34: v50,30.8 v53.5,30.8
PA11-DM  (via drill 0.35)
  Top 0.22: STM32F405RGT6.44 58.34,31.76 58.24,31.67
  Top 0.34: v52.8,30.1 56.67,30.1 58.34,31.76 | v49.3,30.1 48.11,30.1 44.01,26 R7.2
  Bottom 0.34: v49.3,30.1 v52.8,30.1
PA12-DP  (via drill 0.35)
  Top 0.22: 58.59,31.31 STM32F405RGT6.45
  Top 0.34: v48.6,29.4 42.2,23 R9.2 | 58.59,31.31 56.68,29.4 v52.1,29.4
  Bottom 0.34: v52.1,29.4 v48.6,29.4
PA13-RED-P5  (via drill 0.35)
  Top 0.22: 58.95,30.96 STM32F405RGT6.46
  Top 0.34: v63.6,20 64.6,20 79.1,5.5 R15.1 | v58.6,20 53.6,20 49.1,24.5 49.1,26.5 51.2,28.6 56.59,28.6 58.95,30.96
  Bottom 0.34: v63.6,20 v58.6,20
PA14-GRN-P4  (via drill 0.35)
  Top 0.22: STM32F405RGT6.49 63.45,30.35 63.55,30.25
  Top 0.34: R16.1 77.1,8.5 v64.6,21 | v61.6,24 61.6,25.03 63.6,27.03 63.6,30.2 63.45,30.35
  Bottom 0.34: v64.6,21 v61.6,24
PA15-YEL-P3  (via drill 0.35)
  Top 0.22: STM32F405RGT6.50 63.8,30.7 63.9,30.61
  Top 0.34: R17.1 75.09,11.5 65.6,20.99 v65.6,22 | v62.6,25 64.1,26.5 64.1,30.41 63.8,30.7
  Bottom 0.34: v65.6,22 v62.6,25
PB2-BOOT1-MMA-INT
  Top 0.22: STM32F405RGT6.28 55.86,40.76 55.77,40.86
  Top 0.34: R8.1 53.2,47.4 53.2,43.42 55.86,40.76
PB3-SW  (via drill 0.35)
  Top 0.22: STM32F405RGT6.55 64.57,33.47 64.43,33.61
  Top 0.34: v63.6,34.5 63.6,34.44 64.57,33.47
  Top 0.5: J2.6 24.1,62 v51.6,34.5
  Bottom 0.34: v63.6,34.5 v51.6,34.5
PB4-BLU-P2
  Top 0.22: STM32F405RGT6.56 65.92,32.82 66.02,32.73
  Top 0.34: R18.1 73.1,14.5 66.6,21 66.6,32.15 65.92,32.82
PB5-MMA_AVDD
  Top 0.22: STM32F405RGT6.57 66.28,33.18 66.37,33.08
  Top 0.34: R13.1 68.6,28 68.6,30.85 66.28,33.18
PB6-SCL  (via drill 0.35)
  Top 0.22: 66.73,33.43 66.63,33.53 STM32F405RGT6.58 65.6,34.56
  Top 0.34: R19.2 73.6,25 73.6,26.56 66.63,33.53 | 65.6,34.56 64.66,35.5 v64.1,35.5
  Top 0.5: J2.7 16.33,60.73 16.1,60.5 16.1,58.5 18.1,56.5 25.6,56.5 v46.6,35.5
  Bottom 0.34: v64.1,35.5 v46.6,35.5
PB7-SDA  (via drill 0.35)
  Top 0.22: 67.08,33.79 66.98,33.88 STM32F405RGT6.59 65.98,34.88 65.87,35
  Top 0.34: R20.2 75.6,27 73.87,27 66.98,33.88 | 65.98,34.88 64.37,36.5 v64.1,36.5
  Top 0.5: J2.8 24.37,60.73 25.1,60 25.1,59 v47.6,36.5
  Bottom 0.34: v64.1,36.5 v47.6,36.5
PB10-SCL
  Top 0.22: STM32F405RGT6.29 55.51,40.41 55.41,40.51
  Top 0.34: R21.2 52.6,46 52.6,43.32 55.51,40.41
PB11-SDA
  Top 0.22: STM32F405RGT6.30 55.16,40.05 55.06,40.15
  Top 0.34: R22.2 46.1,48.5 49.2,48.5 52.1,45.6 52.1,43.11 55.16,40.05
PC0-ADXL1_INT1  (via drill 0.35)
  Top 0.22: STM32F405RGT6.8 66.28,41.82 66.37,41.92
  Top 0.34: 15.26,40 ADXL375_1.7 18.64,40.04 26.1,47.5 v32.6,47.5 | v72.1,47.5 71.95,47.5 66.28,41.82
  Bottom 0.34: v72.1,47.5 v32.6,47.5
PC1-ADXL1_INT2  (via drill 0.35)
  Top 0.22: STM32F405RGT6.9 65.92,42.18 66.02,42.27
  Top 0.34: 15.24,41 ADXL375_1.8 18.66,41.06 26.1,48.5 v31.6,48.5 | v71.1,48.5 71.1,47.35 65.92,42.18
  Bottom 0.34: v71.1,48.5 v31.6,48.5
PC2-ADXL2_INT1  (via drill 0.35)
  Top 0.22: STM32F405RGT6.10 65.57,42.53 65.67,42.63
  Top 0.34: 107.86,35 ADXL375_2.7 103.64,34.96 91.6,47 v89.6,47 | v70.1,50.5 70.1,47.06 65.57,42.53
  Bottom 0.34: v89.6,47 85.6,51 70.6,51 v70.1,50.5
PC3-ADXL2_INT2  (via drill 0.35)
  Top 0.22: STM32F405RGT6.11 65.22,42.88 65.31,42.98
  Top 0.34: ADXL375_2.8 103.66,33.94 91.6,46 v88.6,46 | v68.1,49.5 68.1,45.77 65.22,42.88
  Bottom 0.34: v68.1,49.5 85.1,49.5 v88.6,46
PC4-REC_LED  (via drill 0.35)
  Top 0.22: STM32F405RGT6.24 58.42,41.04
  Top 0.34: v58.6,38.5 58.6,40.85 58.42,41.04
  Top 0.5: v50.6,37.5 24.83,63.27 J2.4
  Bottom 0.34: v58.6,38.5 57.6,37.5 v50.6,37.5
PC8-SDIO_D0  (via drill 0.35)
  Top 0.22: STM32F405RGT6.39 56.57,33.53 56.47,33.43
  Top 0.34: SD_SLOT.7 v22.6,11.3 | v40.1,21.5 41.8,21.5 53.6,33.29 56.33,33.29 56.57,33.53
  Bottom 0.34: v22.6,11.3 33.9,11.3 40.1,17.5 v40.1,21.5
PC9-SDIO_D1  (via drill 0.35)
  Top 0.22: STM32F405RGT6.40 56.92,33.18 56.83,33.08
  Top 0.34: v41.1,20.5 41.5,20.5 53.8,32.8 56.55,32.8 56.92,33.18 | v22.6,10.2 SD_SLOT.8
  Bottom 0.34: v41.1,20.5 41.1,17.3 34,10.2 v22.6,10.2
PC10-SDIO_D2
  Top 0.22: STM32F405RGT6.51 64.16,31.05 64.25,30.96
  Top 0.34: SD_SLOT.1 57.5,17.9 64.6,25 64.6,30.61 64.16,31.05
PC11-SDIO_D3  (via drill 0.35)
  Top 0.22: STM32F405RGT6.52 64.51,31.41 64.61,31.31
  Top 0.34: SD_SLOT.2 16.99,16.8 v23.6,16.8 R1.1 | v29.1,16.8 57.4,16.8 65.1,24.5 65.1,30.82 64.51,31.41
  Bottom 0.34: v29.1,16.8 v23.6,16.8
PC12-SDIO_CLK  (via drill 0.35)
  Top 0.22: STM32F405RGT6.53 64.86,31.76 64.96,31.67
  Top 0.34: SD_SLOT.5 v23.6,13.5 | v32.4,13.5 34.4,15.5 57.1,15.5 65.6,24 65.6,31.02 64.86,31.76
  Bottom 0.34: v23.6,13.5 v32.4,13.5
PC14-OSC32_IN
  Top 0.22: STM32F405RGT6.3 68.04,40.05 68.14,40.15
  Top 0.34: C2.2 79.27,35.07 Y1.4 76.6,37.74 76.6,39.7 73.9,42.4 70.39,42.4 68.04,40.05
PC15-OSC32_OUT
  Top 0.22: 67.69,40.41 STM32F405RGT6.4
  Top 0.34: C8.2 Y1.1 78.86,40 77,40 74,43 70.28,43 67.69,40.41 | 67.69,40.41
PD2-SDIO_CMD  (via drill 0.35)
  Top 0.22: STM32F405RGT6.54 65.22,32.12 65.31,32.02
  Top 0.34: v35.1,14.5 57.1,14.5 66.09,23.49 66.09,31.23 65.22,32.12 | SD_SLOT.3 v23.6,15.7
  Bottom 0.34: v23.6,15.7 33.9,15.7 v35.1,14.5
PROG
  Top 0.5: LIPO_CHG.5 15.05,55 R11.1
R
  Top 0.34: R15.2 90.1,5.5 91.6,7 102.1,7 106.1,11 LED_RED.1
STAT
  Top 0.34: J2.5 15.1,62 13.6,60.5 13.6,49 14.1,48.5 14.6,48.5 15.05,48.95 LIPO_CHG.1
V+  (via drill 0.35)
  Bottom 2: v105.6,68 105.7,68.1 110.5,68.1 113.6,65 113.6,29.54 (-).2 (-).1
  other vias: 103.6,69 104.6,69 105.6,69 103.6,68 104.6,68 103.6,67 104.6,67 105.6,67
  pour Top: 94,67.1 94,70 106.6,70 106.6,66 102.6,66 101.5,67.1
  pour Bottom: 102.6,70 102.6,66 106.6,66 106.6,70
VBAT  (via drill 0.35)
  Top 0.5: D1.2 97.6,20
  Top 1: C9.1 97.6,20
  Bottom 0.5: BAT_2.1 103.1,38.5 | v98.6,22.7 99.1,22.2 | 23.6,34.5 23.4,34.7 BAT_1.1 20,36.5
  Bottom 2: 103.1,38.5 108.1,38.5 110.6,36 110.6,30 102.8,22.2 99.1,22.2 | 23.6,34.5 23.6,33.5 12.1,22 12.1,6.5 14.1,4.5 83.6,4.5 91.1,12 91.1,19.5 93.8,22.2 97.1,22.2 | v17.1,48.5 14.1,48.5 12.6,47 12.6,39 15.1,36.5 20,36.5
  other vias: 96.6,22.7 97.6,22.7 96.6,21.7 97.6,21.7 98.6,21.7 18.1,49.5 19.1,49.5 19.1,48.5 18.1,48.5 17.1,47.5 18.1,47.5 19.1,47.5
  pour Top: 96.2,18.5 99,18.5 99,23 96.2,23
  pour Bottom: 97.1,37.5 103.6,37.5 103.6,39 102.6,40 97.1,40
  pour Bottom: 95.9,21 99.3,21 99.3,23.4 95.9,23.4
  pour Bottom: 26.6,37.6 26.6,35 20,35 20,37.6
  pour Top: 16.6,50.7 16.6,47 19.6,47 19.6,50.7
  pour Bottom: 16.1,50 20.1,50 20.1,47 16.1,47
VBUS  (via drill 0.35, 0.5)
  Top 0.5: v14.6,32 33.6,32 34.6,33 R2.1
  Top 0.74: J2.3 11.93,63.27
  Top 0.75: 11.93,63.27 v11.2,64
  Bottom 0.5: 9.6,35 11.6,35 v14.6,32
  Bottom 2: v12.2,63 v12.2,62 12.2,54.6 | 12.2,54.6 9.6,52 9.6,35 9.6,5.09 12.6,2.09 85.23,2.09 (+).1 (+).2 | v17.1,53.5 13.3,53.5 12.2,54.6
  other vias: 12.2,64 11.2,63 13.2,63 13.2,64 11.2,62 13.2,62 19.1,52.5 18.1,52.5 18.1,53.5 19.1,54.5 18.1,54.5 17.1,54.5
  pour Top (no thermals): 7.7,63 7.7,61.6 13.5,61.6 13.5,64.3 10.9,64.3 10.9,63.6 10.3,63
  pour Bottom (no thermals): 10.9,64.3 10.9,61.6 13.5,61.6 13.5,64.3
  pour Top: 19.6,51.3 19.6,55 16.6,55 16.6,51.3
  pour Bottom: 16.1,55 20.1,55 20.1,52 16.1,52
  pour Top: 94.8,21.2 94.8,17.8 95.6,17 95.6,13.6 91.6,13.6 91.6,17 92.5,17.9 92.5,21.2
VCAP_1
  Top 0.22: STM32F405RGT6.31 54.8,39.7 54.71,39.8
  Top 0.34: C7.1 49.27,45.23 54.8,39.7
VCAP_2
  Top 0.22: STM32F405RGT6.47 59.4,30.7 59.3,30.61
  Top 0.34: C6.1 53.6,28 56.7,28 59.4,30.7
XTAL1
  Top 0.22: STM32F405RGT6.5 67.09,40.51 67.34,40.76 67.43,40.86
  Top 0.34: 76.57,50 77.4,50 XTAL.2 83.25,49.93 C3.2 | 76.57,50 | 67.34,40.76 76.57,50
XTAL2
  Top 0.22: STM32F405RGT6.6 66.98,41.12 67.08,41.21
  Top 0.34: C4.2 76.33,56.45 XTAL.1 76.2,51.2 76.2,50.33 66.98,41.12
Y
  Top 0.34: R17.2 88.6,11.5 92.1,8 101.1,8 110.1,17 LED_YEL.1

### Text on the board
tPlace: +3V3 | +3V3 | VBUS | PC4-REC_LED | STAT | STAT | PB3-SW | VBUS | PB6-SCL | D+ | D- | GND | PB7-SDA | ID | GND | GND | PC1-ADXL1_INT2 | GND | ADXL375_2 | PC0-ADXL1_INT1 | +3V3 | PA0-SPI1_CS1 | PA7-SPI1_MOSI | PA5-SPI1-SCK | PA6-SPI1_MISO | PA6-SPI1_MISO | PA5-SPI1-SCK | PA7-SPI1_MOSI | PA1-SPI1_CS2 | +3V3 | PC2-ADXL2_INT1 | ADXL375_1 | GND | PC3-ADXL2_INT2 | STEVEN WAAL / CAL POLY, SLO / MTB DAQ / MAIN BOARD / VERSION 2.2 | PC10-SDIO_D2 | PC11-SDIO_D3 | PD2-SDIO_CMD | +3V3 | PC12-SDIO_CLK | GND | PC8-SDIO_D0 | PC9-SDIO-D1 | +3V3 | DFU | BOOT0 | NC | JMP STORE
bPlace: BATTERY / JAUCH QUARTZ #LP402535 / 3.7V / 320 MAH | BATTERY / JAUCH QUARTZ #LP402535 / 3.7V / 320 MAH | BATTERY / ADAFRUIT #285 / 3.7V / 1200 MAH | STEVEN WAAL / CAL POLY, SLO / MTB DAQ / MAIN BOARD / VERSION 2.2 | BATTERY / JAUCH QUARTZ #LP402535 / 3.7V / 320 MAH | BATTERY / JAUCH QUARTZ #LP402535 / 3.7V / 320 MAH